# EAGLE design FluxamasynthParticleTeensy (EAGLE 6.2)
ABBREV: Flux3; AUTHOR: Nadya B.; PROJECT: Fluxamasynth 3
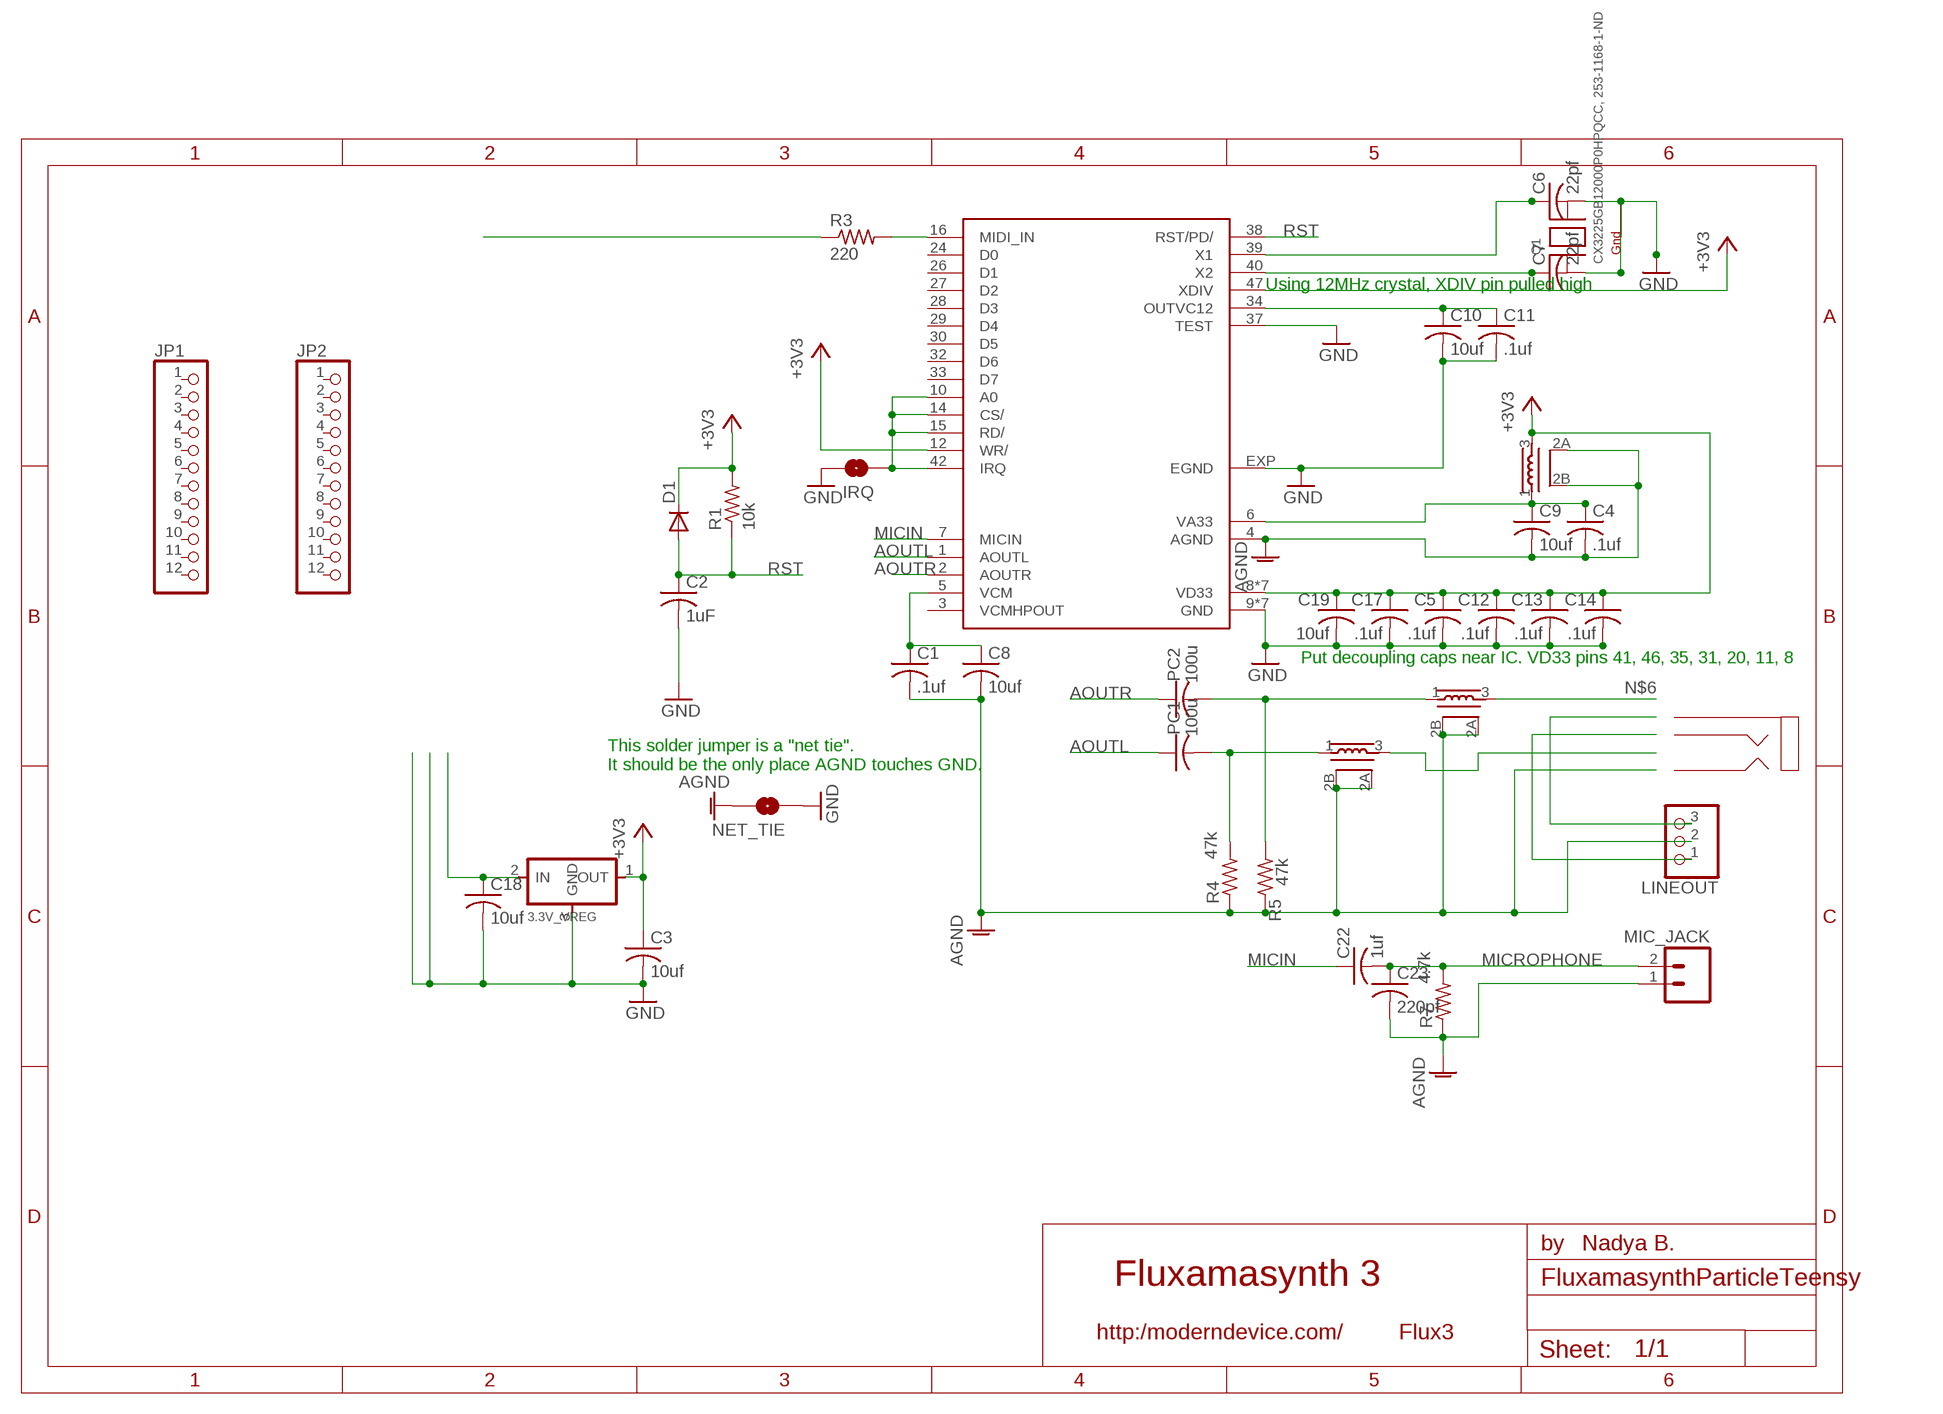
[diagram p0: schematic, sheet 1]

## Parts
3.3V_VREG  REGULATORSOT23  [SOT23]
C1  .1uf  C-USC0603K  [C0603K]
C2  1uF  C-USC0805  [C0805]
C3  10uf  C-USC1206K  [C1206K]
C4  .1uf  C-USC0603K  [C0603K]
C5  .1uf  C-USC0603K  [C0603K]
C6  22pf  C-USC0805  [C0805]
C7  22pf  C-USC0805  [C0805]
C8  10uf  C-USC0805  [C0805]
C9  10uf  C-USC0805  [C0805]
C10  10uf  C-USC0805  [C0805]
C11  .1uf  C-USC0603K  [C0603K]
C12  .1uf  C-USC0603K  [C0603K]
C13  .1uf  C-USC0603K  [C0603K]
C14  .1uf  C-USC0603K  [C0603K]
C17  .1uf  C-USC0603K  [C0603K]
C18  10uf  C-USC1206K  [C1206K]
C19  10uf  C-USC0805  [C0805]
C22  1uf  C-USC0805  [C0805]
C23  220pf  C-USC0805  [C0805]
D1  DIODESOD123  [SOD123]
IRQ  MODERNDEVICE_SOLDERJUMPERTRACE  [MODERNDEVICE_SJ_2S-TRACE]
JP1  PINHD-1X12-CB  [1X12-CB]
JP2  PINHD-1X12-CB  [1X12-CB]
LINEOUT  PINHD-1X3  [1X03]
MIC_JACK  M02PTH  [1X02]
NET_TIE  MODERNDEVICE_SOLDERJUMPERTRACE  [MODERNDEVICE_SJ_2S-TRACE]
PC1  100u  C-USC1206K  [C1206K]
PC2  100u  C-USC1206K  [C1206K]
Q1  CX3225GB12000P0HPQCC, 253-1168-1-ND  MODERNDEVICE_XTAL-4-3225  [MODERNDEVICE_NX3225]
R1  10k  R-US_M0805  [M0805]
R3  220  R-US_M0805  [M0805]
R4  47k  R-US_R0603  [R0603]
R5  47k  R-US_R0603  [R0603]
R7  4.7k  R-US_M0805  [M0805]
SAM2695  SAM2695  [QFN48]
U$1  STEREO_AUDIO_JACK_SMT  [STEREO_AUDIO_JACK_SMT]
U$4  NFM21CC223R1H3D  [3PC]
U$5  NFM21CC223R1H3D  [3PC]
U$7  NFM21CC223R1H3D  [3PC]

## Nets
+3V3 [VCC]: 3.3V_VREG.1(OUT) C3.1 C5.1 C12.1 C13.1 C14.1 C17.1 C19.1 D1.CATHODE(C) R1.2 SAM2695.8(VD33) SAM2695.11(VD33) SAM2695.12(WR/) SAM2695.20(VD33) SAM2695.31(VD33) SAM2695.35(VD33) SAM2695.41(VD33) SAM2695.46(VD33) SAM2695.47(XDIV) U$7.3
AGND [GND]: C1.2 C4.2 C8.2 C9.2 C23.2 LINEOUT.2 MIC_JACK.1 NET_TIE.2 R4.1 R5.1 R7.1 SAM2695.4(AGND) U$4.2A U$4.2B U$5.2A U$5.2B U$7.2A U$7.2B
AOUTL: PC1.1 SAM2695.1(AOUTL)
AOUTR: PC2.1 SAM2695.2(AOUTR)
GND [GND]: 3.3V_VREG.3(GND) C2.2 C3.2 C5.2 C6.2 C7.2 C10.2 C11.2 C12.2 C13.2 C14.2 C17.2 C18.2 C19.2 IRQ.2 NET_TIE.1 Q1.2(G2) Q1.4(G1) SAM2695.9(GND) SAM2695.13(GND) SAM2695.18(GND) SAM2695.25(GND) SAM2695.36(GND) SAM2695.37(TEST) SAM2695.45(GND) SAM2695.48(GND) SAM2695.EXP(EGND)
MICIN: C22.1 SAM2695.7(MICIN)
MICROPHONE: C22.2 C23.1 MIC_JACK.2 R7.2
MIDI_FROM_ARDUINO: R3.1
MIDI_IN: R3.2 SAM2695.16(MIDI_IN)
N$3 [GND]: IRQ.1 SAM2695.10(A0) SAM2695.14(CS/) SAM2695.15(RD/) SAM2695.42(IRQ)
N$5: PC1.2 R4.2 U$5.1
N$6: U$4.3
N$21: LINEOUT.3
N$24: LINEOUT.1
N$48: C6.1 SAM2695.39(X1)
N$49: C7.1 SAM2695.40(X2)
OUT_L: U$5.3
OUT_R: PC2.2 R5.2 U$4.1
OUTVC12: C10.1 C11.1 SAM2695.34(OUTVC12)
RST: C2.1 D1.ANODE(A) R1.1 SAM2695.38(RST/PD/)
VA33 [VCC]: C4.1 C9.1 SAM2695.6(VA33) U$7.1
VCM: C1.1 C8.1 SAM2695.5(VCM)
VIN [VCC]: 3.3V_VREG.2(IN) C18.1
Unconnected: JP1.1 JP1.2 JP1.3 JP1.4 JP1.5 JP1.6 JP1.7 JP1.8 JP1.9 JP1.10 JP1.11 JP1.12 JP2.1 JP2.2 JP2.3 JP2.4 JP2.5 JP2.6 JP2.7 JP2.8 JP2.9 JP2.10 JP2.11 JP2.12 Q1.1(X1) Q1.3(X2) SAM2695.3(VCMHPOUT) SAM2695.24(D0) SAM2695.26(D1) SAM2695.27(D2) SAM2695.28(D3) SAM2695.29(D4) SAM2695.30(D5) SAM2695.32(D6) SAM2695.33(D7) U$1.P$1(SHIELD) U$1.P$2(TIP) U$1.P$3(RING)

## Notes on the sheet
- Using 12MHz crystal, XDIV pin pulled high
- Put decoupling caps near IC. VD33 pins 41, 46, 35, 31, 20, 11, 8
- This solder jumper is a "net tie".
  It should be the only place AGND touches GND.

## Library data of the parts
3.3V_VREG = ng:REGULATOR
C1 C2 C4-C14 C17 C19 C22 C23 = rcl:C-US: CAPACITOR, American symbol
C3 C18 PC1 PC2 = ModernDevice:C-US: CAPACITOR, American symbol
D1 = ng:DIODE: DIODE high speed (Philips)
IRQ NET_TIE = BBLeo_v2:MODERNDEVICE_SOLDERJUMPER: Solder Jumper Standard SMD solder jumper. Used to automate production. Two varients : Normally Open and Normally Closed are the same, but have different paste layers. NC will have a large amount of paste and should jumper during reflow.
JP1 JP2 = adafruit:PINHD-1X12: PIN HEADER
LINEOUT = pinhead:PINHD-1X3: PIN HEADER
MIC_JACK = ModernDevice:M02: Header 2 Standard 2-pin 0.1" header. Use with straight break away headers (SKU : PRT-00116), right angle break away headers (PRT-00553), swiss pins (PRT-00743), machine pins (PRT-00117), and female headers (PRT-00115). Molex polarized connector foot print use with SKU : PRT-08233 with associated crimp pins and housings.
Q1 = BBLeo_v2:MODERNDEVICE_XTAL-4: Classic 4-pin 3.2 x 2.5mm crystal
R1 R3-R5 R7 = rcl:R-US_: RESISTOR, American symbol
SAM2695 = ModernDevice:SAM2695
U$1 = ModernDevice:STEREO_AUDIO_JACK_SMT: Digikey CP-2523SJCT-ND
U$4 U$5 U$7 = nadya_library:NFM21CC223R1H3D: CAPACITOR-TYPE NOISE SUPPRESSION FILTER digikey #NFM21CC223R1H3D

## Net classes
0 default: width 0.2 mm, drill 0.25 mm, clearance 0.2 mm
1 GND: width 0.2 mm, drill 0.25 mm, clearance 0.2 mm
2 VCC: width 0.2 mm, drill 0.25 mm, clearance 0.2 mm
3 VBUS: width 0.2 mm, drill 0.25 mm, clearance 0.25 mm

## Board
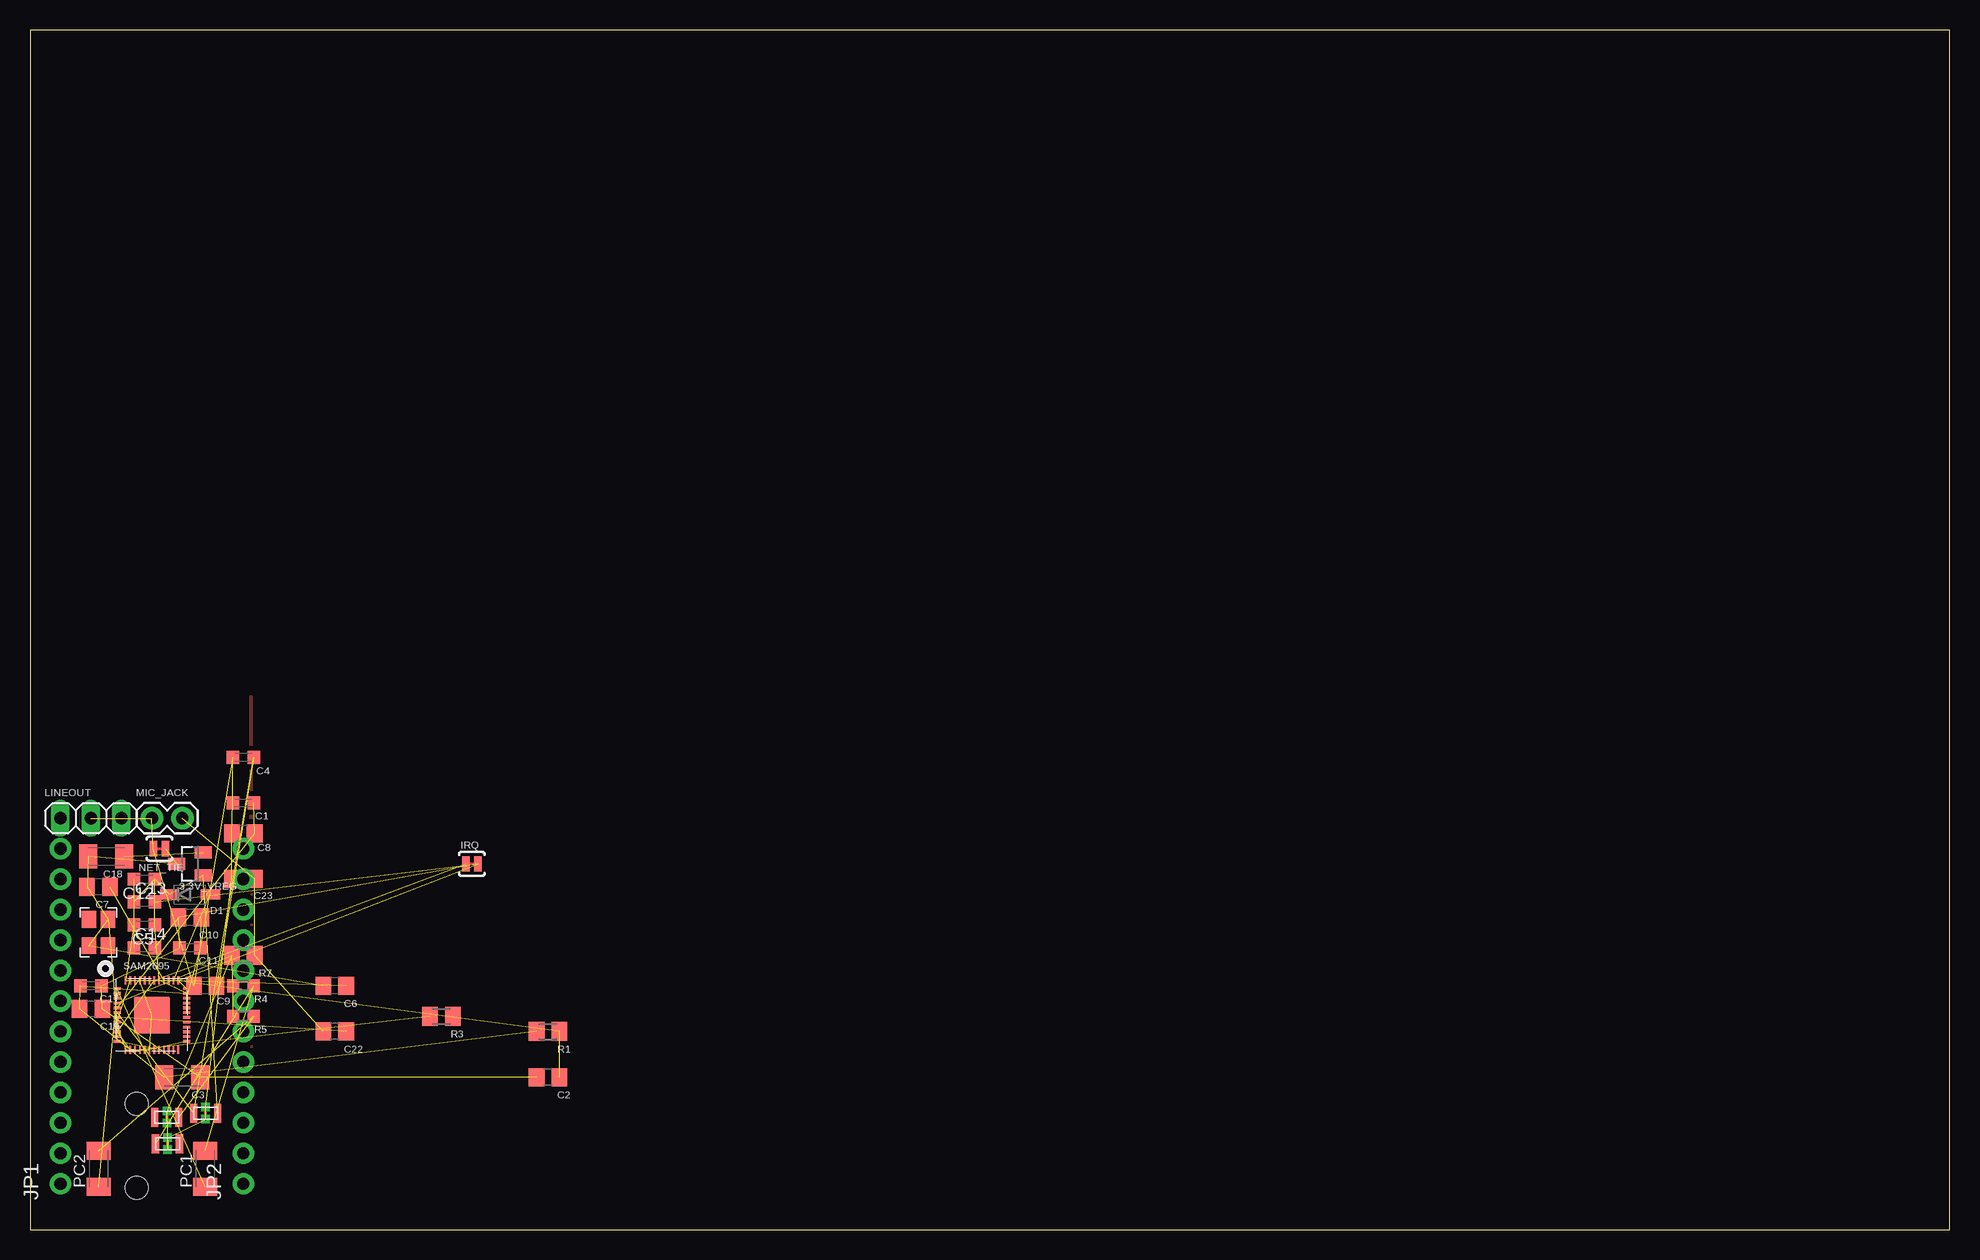
[diagram p1: board, top side]
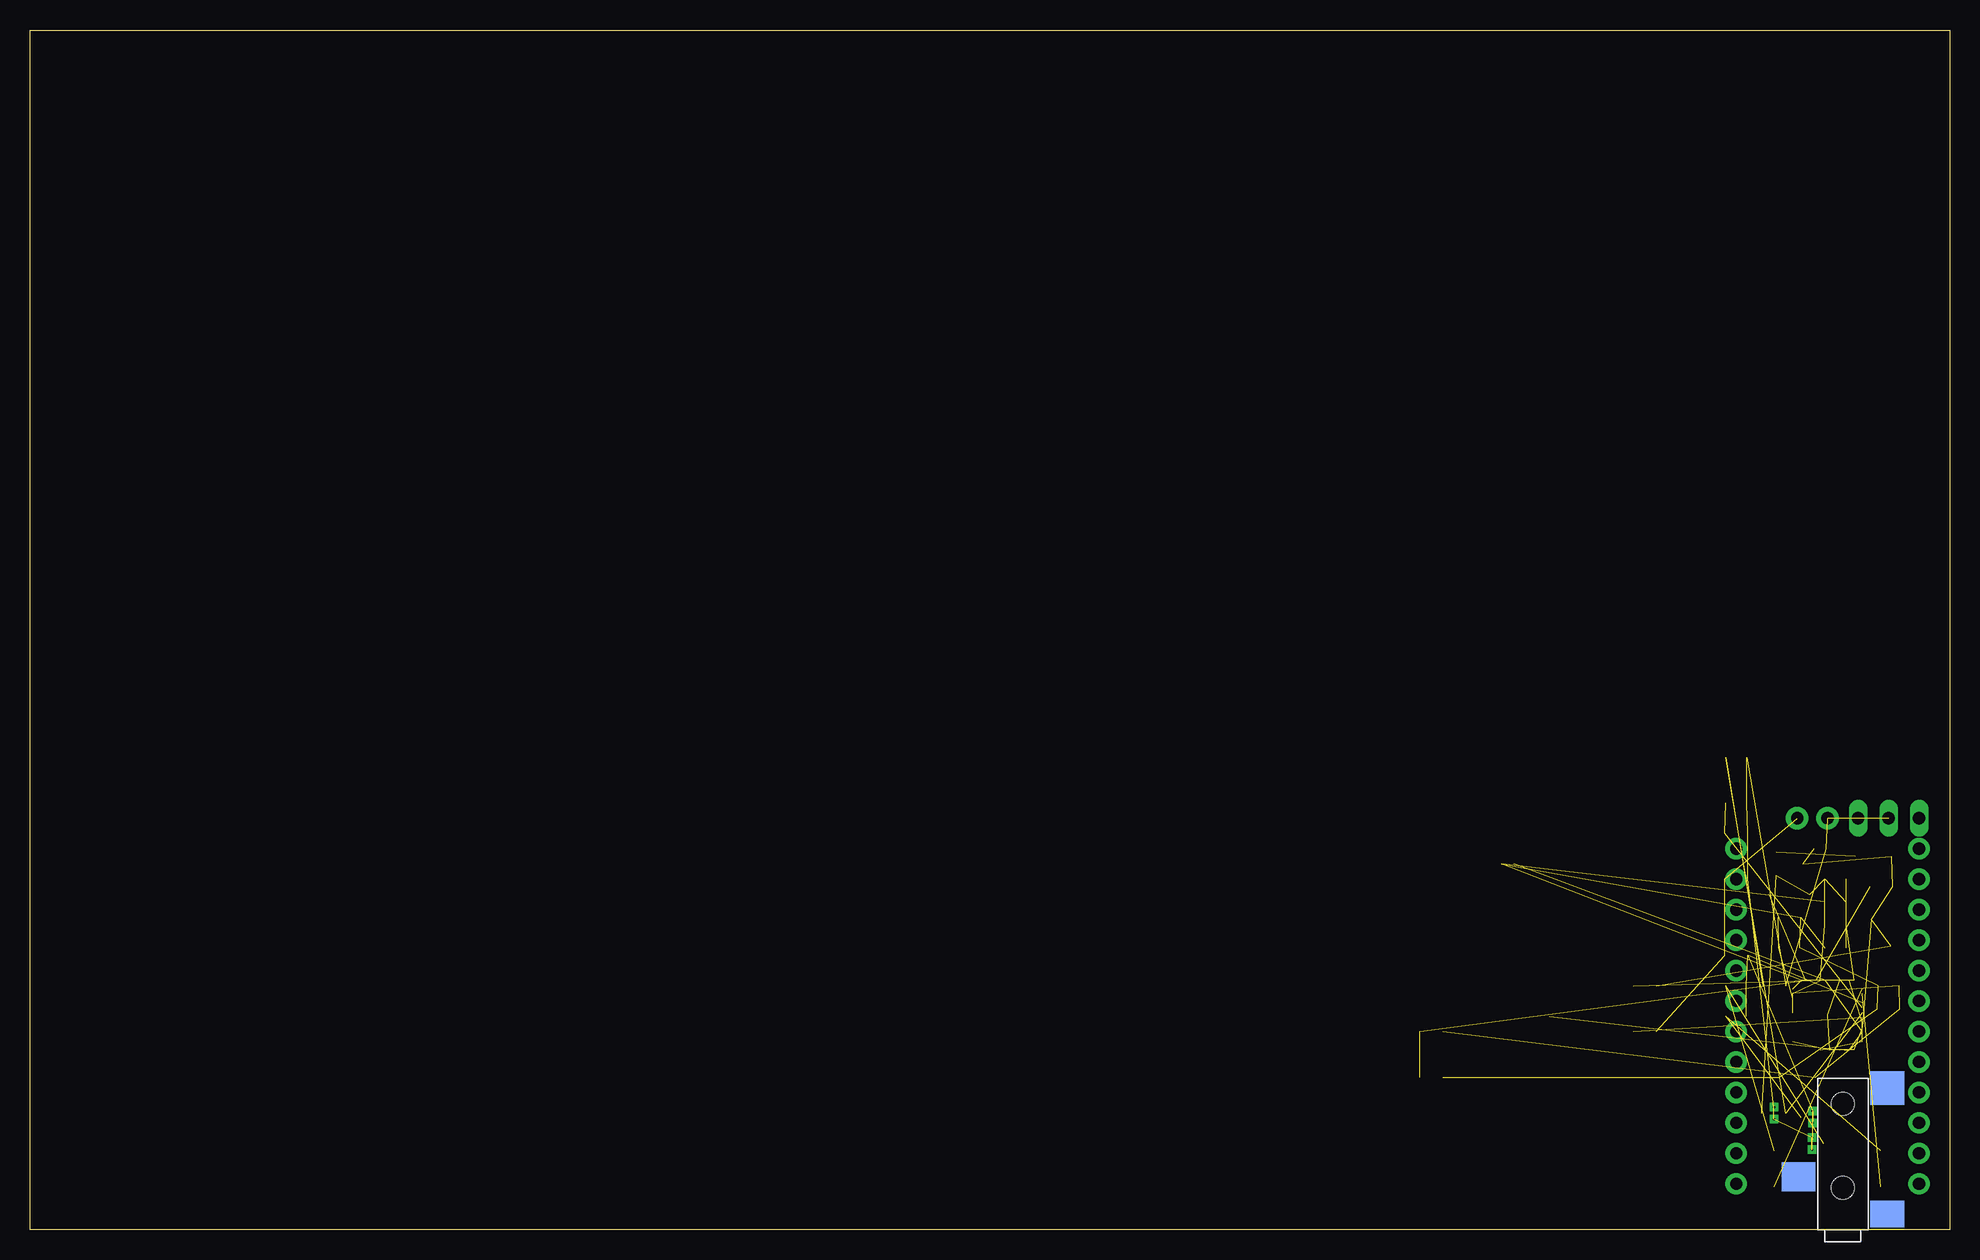
[diagram p2: board, bottom side, seen from below]

Size 160 x 100 mm. Coordinates in mm from the lower left corner, seen from the top.
Outline: 0,0 160,0 160,100 0,100 0,0
Copper layers (1*16): Top 0.035mm / dielectric 1.5mm / Bottom 0.035mm
Design rules: minimum track width 0.2mm, minimum drill 0.25mm, track to track 8mil, track to pad 6mil, pad to pad 6mil, via to via 8mil, smd to smd 6mil, copper to edge 40mil, drill to drill 8mil, minimum pad ring 10mil, minimum via ring 8mil, stop-mask expansion 4mil, vias tented up to drill 0mil, thermal gap 10mil

### Footprints (pad centres in the part's own frame; a part is rotated, then mirrored left to right if it is on the bottom)
SOT23 = smd 1 x 1.4: 1 -0.95,-1.1; 2 0.95,-1.1; 3 0,1.1
C0603K = smd 1.05 x 1.08: 1 -0.875,0; 2 0.875,0
C0805 = smd 1.3 x 1.5: 1 -0.95,0; 2 0.95,0
C1206K = smd 1.5 x 2: 1 -1.5,0; 2 1.5,0
SOD123 = smd 1.6 x 0.8: ANODE 1.7,0; CATHODE -1.7,0
MODERNDEVICE_SJ_2S-TRACE = smd 0.635 x 1.27: 1 -0.508,0; 2 0.508,0
1X12-CB = drill 1.016 pad 1.778: 1 -13.97,0; 2 -11.43,0; 3 -8.89,0; 4 -6.35,0; 5 -3.81,0; 6 -1.27,0; 7 1.27,0; 8 3.81,0; 9 6.35,0; 10 8.89,0; 11 11.43,0; 12 13.97,0
1X03 = drill 1.016 long: 1 -2.54,0; 2 0,0; 3 2.54,0
1X02 = drill 1.016 pad 1.88: 1 0,0; 2 2.54,0
MODERNDEVICE_NX3225 = smd 1.4 x 1.2: 1 -1.1,-0.8; 2 1.1,-0.8; 3 1.1,0.8; 4 -1.1,0.8
M0805 = smd 1.3 x 1.6: 1 -0.95,0; 2 0.95,0
R0603 = smd 1 x 1.1: 1 -0.85,0; 2 0.85,0
QFN48 = smd 0.65 x 0.2: 1 -2.9,2.3; 2 -2.9,1.9; 3 -2.9,1.5; 4 -2.9,1.1; 5 -2.9,0.7; 6 -2.9,0.3; 7 -2.9,-0.1; 8 -2.9,-0.5; 9 -2.9,-0.9; 10 -2.9,-1.3; 11 -2.9,-1.7; 12 -2.9,-2.1; 25 2.9,-2.1; 26 2.9,-1.7; 27 2.9,-1.3; 28 2.9,-0.9; 29 2.9,-0.5; 30 2.9,-0.1; 31 2.9,0.3; 32 2.9,0.7; 33 2.9,1.1; 34 2.9,1.5; 35 2.9,1.9; 36 2.9,2.3 | smd 0.2 x 0.65: 13 -2.2,-2.8; 14 -1.8,-2.8; 15 -1.4,-2.8; 16 -1,-2.8; 17 -0.6,-2.8; 18 -0.2,-2.8; 19 0.2,-2.8; 20 0.6,-2.8; 21 1,-2.8; 22 1.4,-2.8; 23 1.8,-2.8; 24 2.2,-2.8; 37 2.2,3; 38 1.8,3; 39 1.4,3; 40 1,3; 41 0.6,3; 42 0.2,3; 43 -0.2,3; 44 -0.6,3; 45 -1,3; 46 -1.4,3; 47 -1.8,3; 48 -2.2,3 | smd 3 x 3: EXP 0,0.1
STEREO_AUDIO_JACK_SMT = smd 2.8 x 2.2: P$1 3.7,1.3 | smd 2.8 x 2.8: P$2 3.7,11.8 | smd 2.8 x 2.4: P$3 -3.7,4.4 | hole 1.9: 0,3.5; 0,10.5
3PC = smd 0.6 x 1.6: 1 0.3,0.8; 3 2.3,0.8 | drill 0.2 pad 0.6 square: 2A 1.3,1.3; 2B 1.3,0.3

### Placement (x,y rotation side)
3.3V_VREG  13.34,30.48 90 top
C1  17.78,35.56 180 top
C2  43.18,12.7 180 top
C3  12.7,12.7 0 top
C4  17.78,39.37 180 top
C5  9.53,25.4 180 top
C6  25.4,20.32 180 top
C7  5.71,28.57 180 top
C8  17.78,33.02 180 top
C9  14.61,20.32 180 top
C10  13.34,26.04 180 top
C11  13.34,23.5 180 top
C12  9.53,29.21 180 top
C13  9.53,27.3 0 top
C14  9.53,23.5 0 top
C17  5.08,20.32 0 top
C18  6.35,31.11 180 top
C19  5.08,18.41 0 top
C22  25.4,16.51 180 top
C23  17.78,29.21 180 top
D1  13.34,27.94 0 top
IRQ  36.83,30.48 0 top
JP1  2.54,17.78 90 top
JP2  17.78,17.78 90 top
LINEOUT  5.08,34.29 0 top
MIC_JACK  10.16,34.29 0 top
NET_TIE  10.79,31.75 180 top
PC1  14.61,5.08 90 top
PC2  5.71,5.08 90 top
Q1  5.71,24.77 270 top
R1  43.18,16.51 180 top
R3  34.29,17.78 180 top
R4  17.78,20.32 0 top
R5  17.78,17.78 0 top
R7  17.78,22.86 0 top
SAM2695  10.16,17.78 0 top
U$1  8.89,0 0 bottom
U$4  12.7,10.16 180 top
U$5  10.16,6.35 0 top
U$7  13.34,8.89 0 top

### Tracks (layer width: path | path; a pad name or v marks a point on that pad's centre or on a via)
+3V3  (19 unrouted)
AGND  (17 unrouted)
AOUTL  (1 unrouted)
AOUTR  (1 unrouted)
GND  (26 unrouted)
  pour Top (isolate 0.406): 18.44,44.45 18.44,44.45 18.44,12.7
MICIN  (1 unrouted)
MICROPHONE  (3 unrouted)
MIDI_IN  (1 unrouted)
N$3  (4 unrouted)
N$5  (2 unrouted)
N$48  (1 unrouted)
N$49  (1 unrouted)
OUT_R  (2 unrouted)
OUTVC12  (2 unrouted)
RST  (3 unrouted)
VA33  (3 unrouted)
VCM  (2 unrouted)
VIN  (1 unrouted)